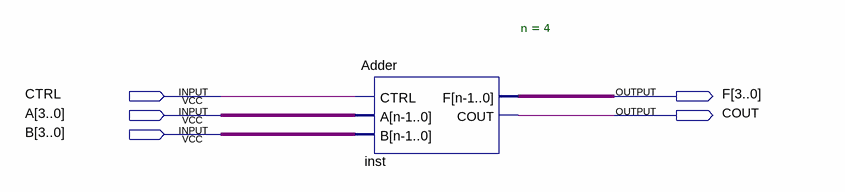
[diagram p0: schematic sheet]
// Quartus schematic ADDER4BIT.bdf as structural Verilog: 1 symbols, 5 pins
module ADDER4BIT (
  input  CTRL,
  input  [3:0] A,
  input  [3:0] B,
  output [3:0] F,
  output COUT
);

  Adder #(.n(4)) inst (.CTRL(CTRL), .A(A), .B(B), .F(F), .COUT(COUT));
endmodule
